# EAGLE design ECU_1v0 (EAGLE 9.0.1)
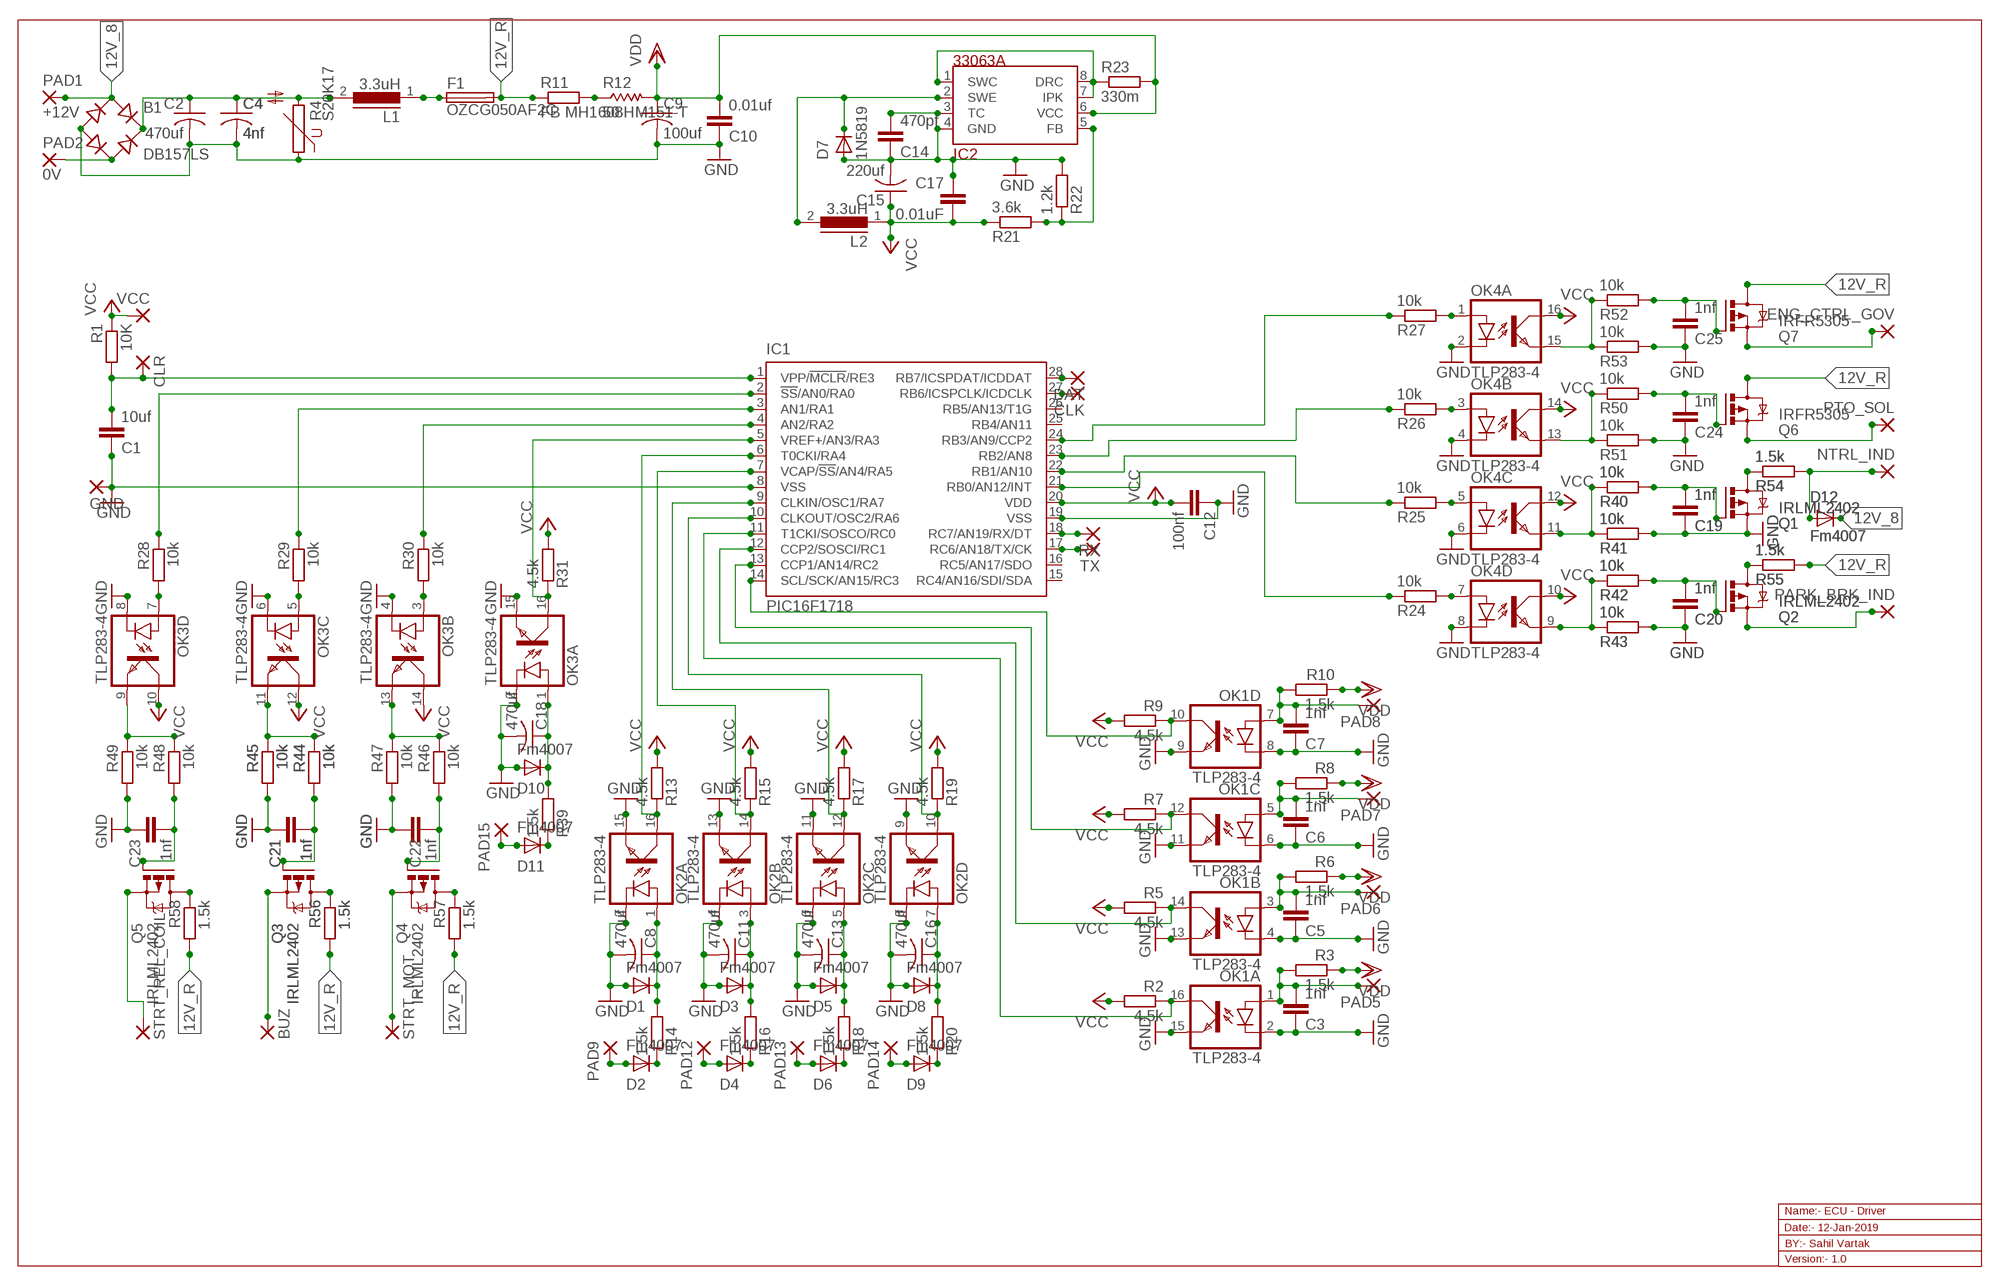
[diagram p0: schematic, sheet 1]

## Parts
B1  DB157LS  DBS106G  [DBS]
BUZ  2,54/1,1  [2,54/1,1]
C1  10uf  CC0603  [C0603]
C2  470uf  C-US050-075X075  [C050-075X075]
C3  1nf  CC0603  [C0603]
C4  4nf  C-US050-045X075  [C050-045X075]
C5  1nf  CC0603  [C0603]
C6  1nf  CC0603  [C0603]
C7  1nf  CC0603  [C0603]
C8  470uf  C-US050-075X075  [C050-075X075]
C9  100uf  C-US025-025X050  [C025-025X050]
C10  0.01uf  CC0603  [C0603]
C11  470uf  C-US050-075X075  [C050-075X075]
C12  100nf  CC0603  [C0603]
C13  470uf  C-US050-075X075  [C050-075X075]
C14  470pf  CC0603  [C0603]
C15  220uf  C-US025-025X050  [C025-025X050]
C16  470uf  C-US050-075X075  [C050-075X075]
C17  0.01uF  CC0603  [C0603]
C18  470uf  C-US050-075X075  [C050-075X075]
C19  1nf  CC0603  [C0603]
C20  1nf  CC0603  [C0603]
C21  1nf  CC0603  [C0603]
C22  1nf  CC0603  [C0603]
C23  1nf  CC0603  [C0603]
C24  1nf  CC0603  [C0603]
C25  1nf  CC0603  [C0603]
CLK  1,6/0,8  [1,6/0,8]
CLR  1,6/0,8  [1,6/0,8]
D1  Fm4007  GF1  [SMA-DO214AC]
D2  Fm4007  GF1  [SMA-DO214AC]
D3  Fm4007  GF1  [SMA-DO214AC]
D4  Fm4007  GF1  [SMA-DO214AC]
D5  Fm4007  GF1  [SMA-DO214AC]
D6  Fm4007  GF1  [SMA-DO214AC]
D7  1N5819  GF1  [SMA-DO214AC]
D8  Fm4007  GF1  [SMA-DO214AC]
D9  Fm4007  GF1  [SMA-DO214AC]
D10  Fm4007  GF1  [SMA-DO214AC]
D11  Fm4007  GF1  [SMA-DO214AC]
D12  Fm4007  GF1  [SMA-DO214AC]
DAT  1,6/0,8  [1,6/0,8]
ENG_CTRL_GOV  2,54/1,1  [2,54/1,1]
F1  OZCG050AF2C  RES_FUSE  [RES_FUSE]
GND  1,6/0,8  [1,6/0,8]
IC1  PIC16F1718  PIC16F1516/18SO  [SO28W]
IC2  33063A  [D_R-PDSO-G8]
L1  3.3uH  82114R  [82114R]
L2  3.3uH  82114R  [82114R]
NTRL_IND  2,54/1,1  [2,54/1,1]
OK1  TLP283-4  [MINI-FLAT-16]
OK2  TLP283-4  [MINI-FLAT-16]
OK3  TLP283-4  [MINI-FLAT-16]
OK4  TLP283-4  [MINI-FLAT-16]
PAD1  +12V  2,54/1,1  [2,54/1,1]
PAD2  0V  2,54/1,1  [2,54/1,1]
PAD5  2,54/1,1  [2,54/1,1]
PAD6  2,54/1,1  [2,54/1,1]
PAD7  2,54/1,1  [2,54/1,1]
PAD8  2,54/1,1  [2,54/1,1]
PAD9  2,54/1,1  [2,54/1,1]
PAD12  2,54/1,1  [2,54/1,1]
PAD13  2,54/1,1  [2,54/1,1]
PAD14  2,54/1,1  [2,54/1,1]
PAD15  2,54/1,1  [2,54/1,1]
PARK_BRK_IND  2,54/1,1  [2,54/1,1]
PTO_SOL  2,54/1,1  [2,54/1,1]
Q1  IRLML2402  IRLML5203  [MICRO3]
Q2  IRLML2402  IRLML5203  [MICRO3]
Q3  IRLML2402  IRLML5203  [MICRO3]
Q4  IRLML2402  IRLML5203  [MICRO3]
Q5  IRLML2402  IRLML5203  [MICRO3]
Q6  IRFR5305  [D-PAK_TO252AA]
Q7  IRFR5305  [D-PAK_TO252AA]
R1  10K  RR0603  [R0603]
R2  4.5k  RR0603  [R0603]
R3  1.5k  RR0603  [R0603]
R4  S20K17  S14K17  [S14K17]
R5  4.5k  RR0603  [R0603]
R6  1.5k  RR0603  [R0603]
R7  4.5k  RR0603  [R0603]
R8  1.5k  RR0603  [R0603]
R9  4.5k  RR0603  [R0603]
R10  1.5k  RR0603  [R0603]
R11  FB MH1608HM151-T  R-EU_R0603  [R0603]
R12  50  R-US_WSC2515  [WSC2515]
R13  4.5k  RR0603  [R0603]
R14  1.5k  RR0603  [R0603]
R15  4.5k  RR0603  [R0603]
R16  1.5k  RR0603  [R0603]
R17  4.5k  RR0603  [R0603]
R18  1.5k  RR0603  [R0603]
R19  4.5k  RR0603  [R0603]
R20  1.5k  RR0603  [R0603]
R21  3.6k  RR0603  [R0603]
R22  1.2k  RR0603  [R0603]
R23  330m  RR2010  [R2010]
R24  10k  RR0603  [R0603]
R25  10k  RR0603  [R0603]
R26  10k  RR0603  [R0603]
R27  10k  RR0603  [R0603]
R28  10k  RR0603  [R0603]
R29  10k  RR0603  [R0603]
R30  10k  RR0603  [R0603]
R31  4.5k  RR0603  [R0603]
R39  1.5k  RR0603  [R0603]
R40  10k  RR0603  [R0603]
R41  10k  RR0603  [R0603]
R42  10k  RR0603  [R0603]
R43  10k  RR0603  [R0603]
R44  10k  RR0603  [R0603]
R45  10k  RR0603  [R0603]
R46  10k  RR0603  [R0603]
R47  10k  RR0603  [R0603]
R48  10k  RR0603  [R0603]
R49  10k  RR0603  [R0603]
R50  10k  RR0603  [R0603]
R51  10k  RR0603  [R0603]
R52  10k  RR0603  [R0603]
R53  10k  RR0603  [R0603]
R54  1.5k  RR0603  [R0603]
R55  1.5k  RR0603  [R0603]
R56  1.5k  RR0603  [R0603]
R57  1.5k  RR0603  [R0603]
R58  1.5k  RR0603  [R0603]
RX  1,6/0,8  [1,6/0,8]
STRT_MOT  2,54/1,1  [2,54/1,1]
STRT_REL_COIL  2,54/1,1  [2,54/1,1]
TX  1,6/0,8  [1,6/0,8]
VCC  1,6/0,8  [1,6/0,8]

## Nets
12V_8: B1.AC1 D12.K(C) PAD1.1(P)
12V_R: F1.2 Q6.4(D) Q7.4(D) R11.1 R55.2 R56.2 R57.2 R58.2
GND: B1.- C1.1 C2.2 C3.1 C4.2 C5.1 C6.1 C7.1 C8.2 C9.2 C10.1 C11.2 C12.1 C13.2 C14.1 C15.2 C16.2 C17.1 C18.2 C19.1 C20.1 C21.1 C22.1 C23.1 C24.1 C25.1 D1.A D3.A D5.A D7.A D8.A D10.A GND.1(P) IC1.8(VSS) IC1.19(VSS) IC2.4(GND) OK1.2(A:C) OK1.4(B:C) OK1.6(C:C) OK1.8(D:C) OK1.9(D:EMIT) OK1.11(C:EMIT) OK1.13(B:EMIT) OK1.15(A:EMIT) OK2.2(A:C) OK2.4(B:C) OK2.6(C:C) OK2.8(D:C) OK2.9(D:EMIT) OK2.11(C:EMIT) OK2.13(B:EMIT) OK2.15(A:EMIT) OK3.2(A:C) OK3.4(B:C) OK3.6(C:C) OK3.8(D:C) OK3.15(A:EMIT) OK4.2(A:C) OK4.4(B:C) OK4.6(C:C) OK4.8(D:C) Q1.2(S) R4.1 R22.2 R41.2 R43.2 R45.2 R47.2 R49.2 R51.2 R53.2
N$1: IC1.4(AN2/RA2) R30.1
N$3: IC1.21(RB0/AN12/INT) R24.1
N$5: PARK_BRK_IND.1(P) Q2.2(S)
N$6: IC1.10(CLKOUT/OSC2/RA6) OK2.10(D:COL) R19.1
N$7: IC1.11(T1CKI/SOSCO/RC0) OK1.16(A:COL) R2.1
N$8: IC1.23(RB2/AN8) R26.1
N$9: IC1.13(CCP1/AN14/RC2) OK1.12(C:COL) R7.1
N$13: IC1.14(SCL/SCK/AN15/RC3) OK1.10(D:COL) R9.1
N$14: C1.2 CLR.1(P) IC1.1(VPP/!MCLR!/RE3) R1.2
N$15: R11.2 R12.1
N$16: IC1.24(RB3/AN9/CCP2) R27.1
N$17: IC1.22(RB1/AN10) R25.1
N$18: IC2.1(SWC) IC2.7(IPK) IC2.8(DRC) R23.1
N$19: C14.2 IC2.3(TC)
N$20: BUZ.1(P) Q3.2(S)
N$21: F1.1 L1.1
N$22: D7.K(C) IC2.2(SWE) L2.2
N$23: IC2.5(FB) R21.2 R22.1
N$24: Q4.2(S) STRT_MOT.1(P)
N$25: Q5.2(S) STRT_REL_COIL.1(P)
N$26: PTO_SOL.1(P) Q6.3(S)
N$27: ENG_CTRL_GOV.1(P) Q7.3(S)
N$28: IC1.18(RC7/AN19/RX/DT) RX.1(P)
N$29: B1.+ C2.1 C4.1 L1.2 R4.2
N$30: IC1.17(RC6/AN18/TX/CK) TX.1(P)
N$35: C3.2 OK1.1(A:A) PAD5.1(P) R3.2
N$37: B1.AC2 PAD2.1(P)
N$38: C5.2 OK1.3(B:A) PAD6.1(P) R6.2
N$39: C6.2 OK1.5(C:A) PAD7.1(P) R8.2
N$40: C7.2 OK1.7(D:A) PAD8.1(P) R10.2
N$41: C8.1 D1.K(C) OK2.1(A:A) R14.2
N$42: D2.K(C) R14.1
N$43: D2.A PAD9.1(P)
N$44: C11.1 D3.K(C) OK2.3(B:A) R16.2
N$45: D4.K(C) R16.1
N$46: D4.A PAD12.1(P)
N$47: C13.1 D5.K(C) OK2.5(C:A) R18.2
N$48: D6.K(C) R18.1
N$49: D6.A PAD13.1(P)
N$50: C16.1 D8.K(C) OK2.7(D:A) R20.2
N$51: D9.K(C) R20.1
N$52: D9.A PAD14.1(P)
N$53: C18.1 D10.K(C) OK3.1(A:A) R39.2
N$54: D11.K(C) R39.1
N$55: D11.A PAD15.1(P)
N$56: OK4.7(D:A) R24.2
N$57: OK4.5(C:A) R25.2
N$58: OK4.3(B:A) R26.2
N$59: OK4.1(A:A) R27.2
N$60: OK3.7(D:A) R28.2
N$61: OK3.5(C:A) R29.2
N$62: OK3.3(B:A) R30.2
N$63: IC1.2(!SS!/AN0/RA0) R28.1
N$64: IC1.3(AN1/RA1) R29.1
N$66: IC1.5(VREF+/AN3/RA3) OK3.16(A:COL) R31.1
N$67: IC1.6(T0CKI/RA4) OK2.16(A:COL) R13.1
N$68: IC1.7(VCAP/!SS!/AN4/RA5) OK2.14(B:COL) R15.1
N$69: IC1.9(CLKIN/OSC1/RA7) OK2.12(C:COL) R17.1
N$83: IC1.12(CCP2/SOSCI/RC1) OK1.14(B:COL) R5.1
N$86: C19.2 Q1.1(G) R40.2
N$96: C20.2 Q2.1(G) R42.2
N$97: OK4.11(C:EMIT) R40.1 R41.1
N$98: OK4.9(D:EMIT) R42.1 R43.1
N$99: C21.2 Q3.1(G) R44.2
N$100: OK3.11(C:EMIT) R44.1 R45.1
N$101: C22.2 Q4.1(G) R46.2
N$102: OK3.13(B:EMIT) R46.1 R47.1
N$103: C23.2 Q5.1(G) R48.2
N$104: OK3.9(D:EMIT) R48.1 R49.1
N$105: C24.2 Q6.1(G) R50.2
N$106: OK4.13(B:EMIT) R50.1 R51.1
N$107: C25.2 Q7.1(G) R52.2
N$108: OK4.15(A:EMIT) R52.1 R53.1
N$111: Q1.3(D) R54.1
N$112: Q2.3(D) R55.1
N$113: Q3.3(D) R56.1
N$114: Q4.3(D) R57.1
N$115: Q5.3(D) R58.1
N$116: D12.A NTRL_IND.1(P) R54.2
N$123: DAT.1(P) IC1.28(RB7/ICSPDAT/ICDDAT)
N$124: CLK.1(P) IC1.27(RB6/ICSPCLK/ICDCLK)
VCC: C12.2 C15.1 C17.2 IC1.20(VDD) L2.1 OK3.10(D:COL) OK3.12(C:COL) OK3.14(B:COL) OK4.10(D:COL) OK4.12(C:COL) OK4.14(B:COL) OK4.16(A:COL) R1.1 R2.2 R5.2 R7.2 R9.2 R13.2 R15.2 R17.2 R19.2 R21.1 R31.2 VCC.1(P)
VDD: C9.1 C10.2 IC2.6(VCC) R3.1 R6.1 R8.1 R10.1 R12.2 R23.2
Unconnected: IC1.15(RC4/AN16/SDI/SDA) IC1.16(RC5/AN17/SDO) IC1.25(RB4/AN11) IC1.26(RB5/AN13/T1G)

## Notes on the sheet
- Name:- ECU - Driver
- Date:- 12-Jan-2019
- BY:- Sahil Vartak
- Version:- 1.0

## Library data of the parts
B1 = rectifier:DB?*G: Single Phase 1.0 AMP Glass Passivated Bridge Rectifier Taiwan Semiconductor Co.,Ltd. - TSC Source: http://www.taiwansemi.com/TSCbig5/ezcatfiles/cust/img/img/db101g.pdf http://www.ts.com.tw/db/pictures/modules/PDT/PDT060207001/DBLS201G.pdf
BUZ ENG_CTRL_GOV NTRL_IND PAD1 PAD2 PAD5-PAD9 PAD12-PAD15 PARK_BRK_IND PTO_SOL STRT_MOT STRT_REL_COIL = wirepad:2,54/1,1: THROUGH-HOLE PAD
C1 C3 C5-C7 C10 C12 C14 C17 C19-C25 = eagle-ltspice:C: CAPACITOR, European symbol; SPICEMODEL: NONE; SPICEPREFIX: C
C2 C8 C11 C13 C16 C18 = resistor:C-US: CAPACITOR, American symbol
C4 C9 C15 = rcl:C-US: CAPACITOR, American symbol
CLK CLR DAT GND RX TX VCC = wirepad:1,6/0,8: THROUGH-HOLE PAD
D1-D12 = diode:GF1: DIODE
F1 = fuse:RES_FUSE
IC1 = microchip:PIC16*F1516/18: 28/40/44-Pin Flash Microcontrollers with nanoWatt XLP Technology PIC16F1516/1518 AND PIC16LF1516/1518 Source: www.microchip.com PIC16F1516.pdf
IC2 = linear:33063A
L1 L2 = inductors:82114R: INDUCTOR; SPICEPREFIX: L
OK1-OK4 = optocoupler:TLP283-4: TOSHIBA PHOTOCOUPLER GaAs IRED & PHOTO-TRANSISTOR Source: http://www.semicon.toshiba.co.jp/td/en/Opto/Photocoupler/en_20050928_TLP283_datasheet.pdf; OC_FARNELL: unknown; OC_NEWARK: unknown
Q1-Q5 = transistor-power:IRLML5203: HEXFET P-Channel Power MOSFET
Q6 Q7 = transistor-power:IRF?5305: HEXFET Power MOSFET Source: http://www.irf.com/product-info/datasheets/data/irfr5305pbf.pdf
R1-R3 R5-R10 R13-R31 R39-R58 = eagle-ltspice:R: RESISTOR, European symbol; SPICEMODEL: NONE; SPICEPREFIX: R
R4 = varistor:S14K17: VARISTOR
R11 = resistor:R-EU_: RESISTOR, European symbol
R12 = resistor:R-US_: RESISTOR, American symbol

## Board
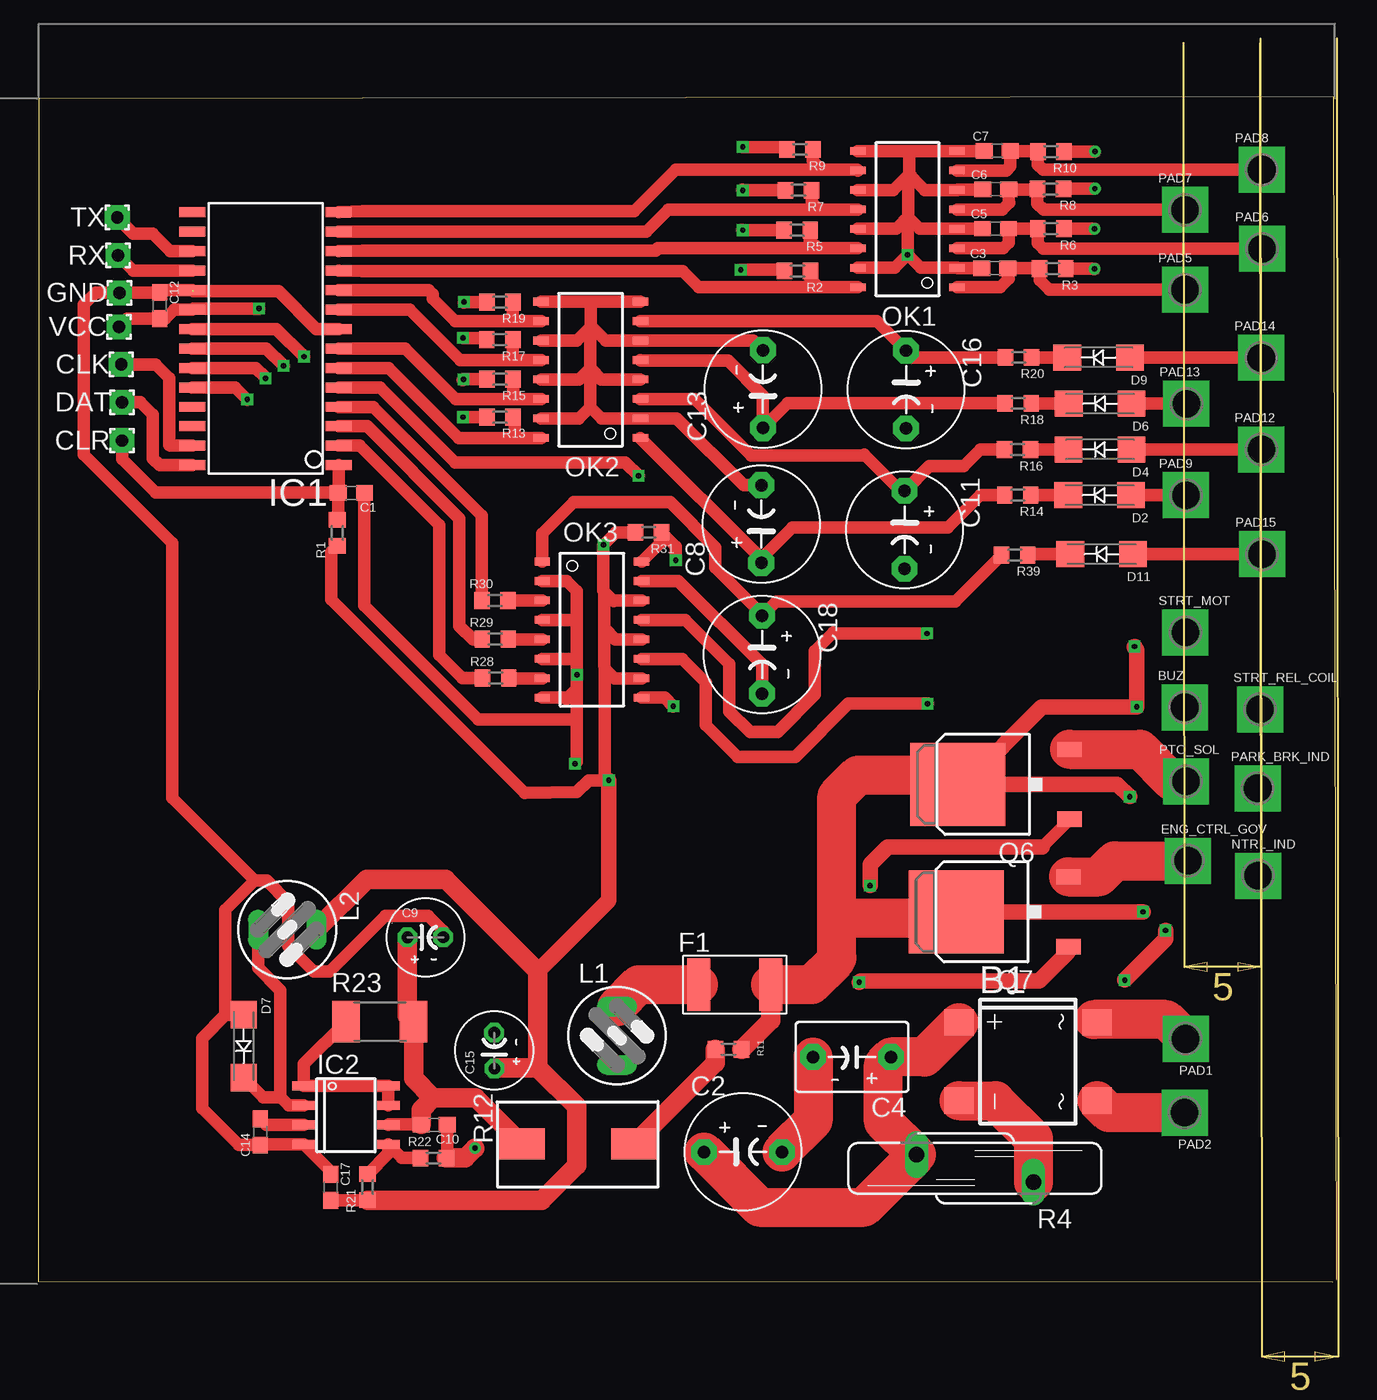
[diagram p1: board, top side]
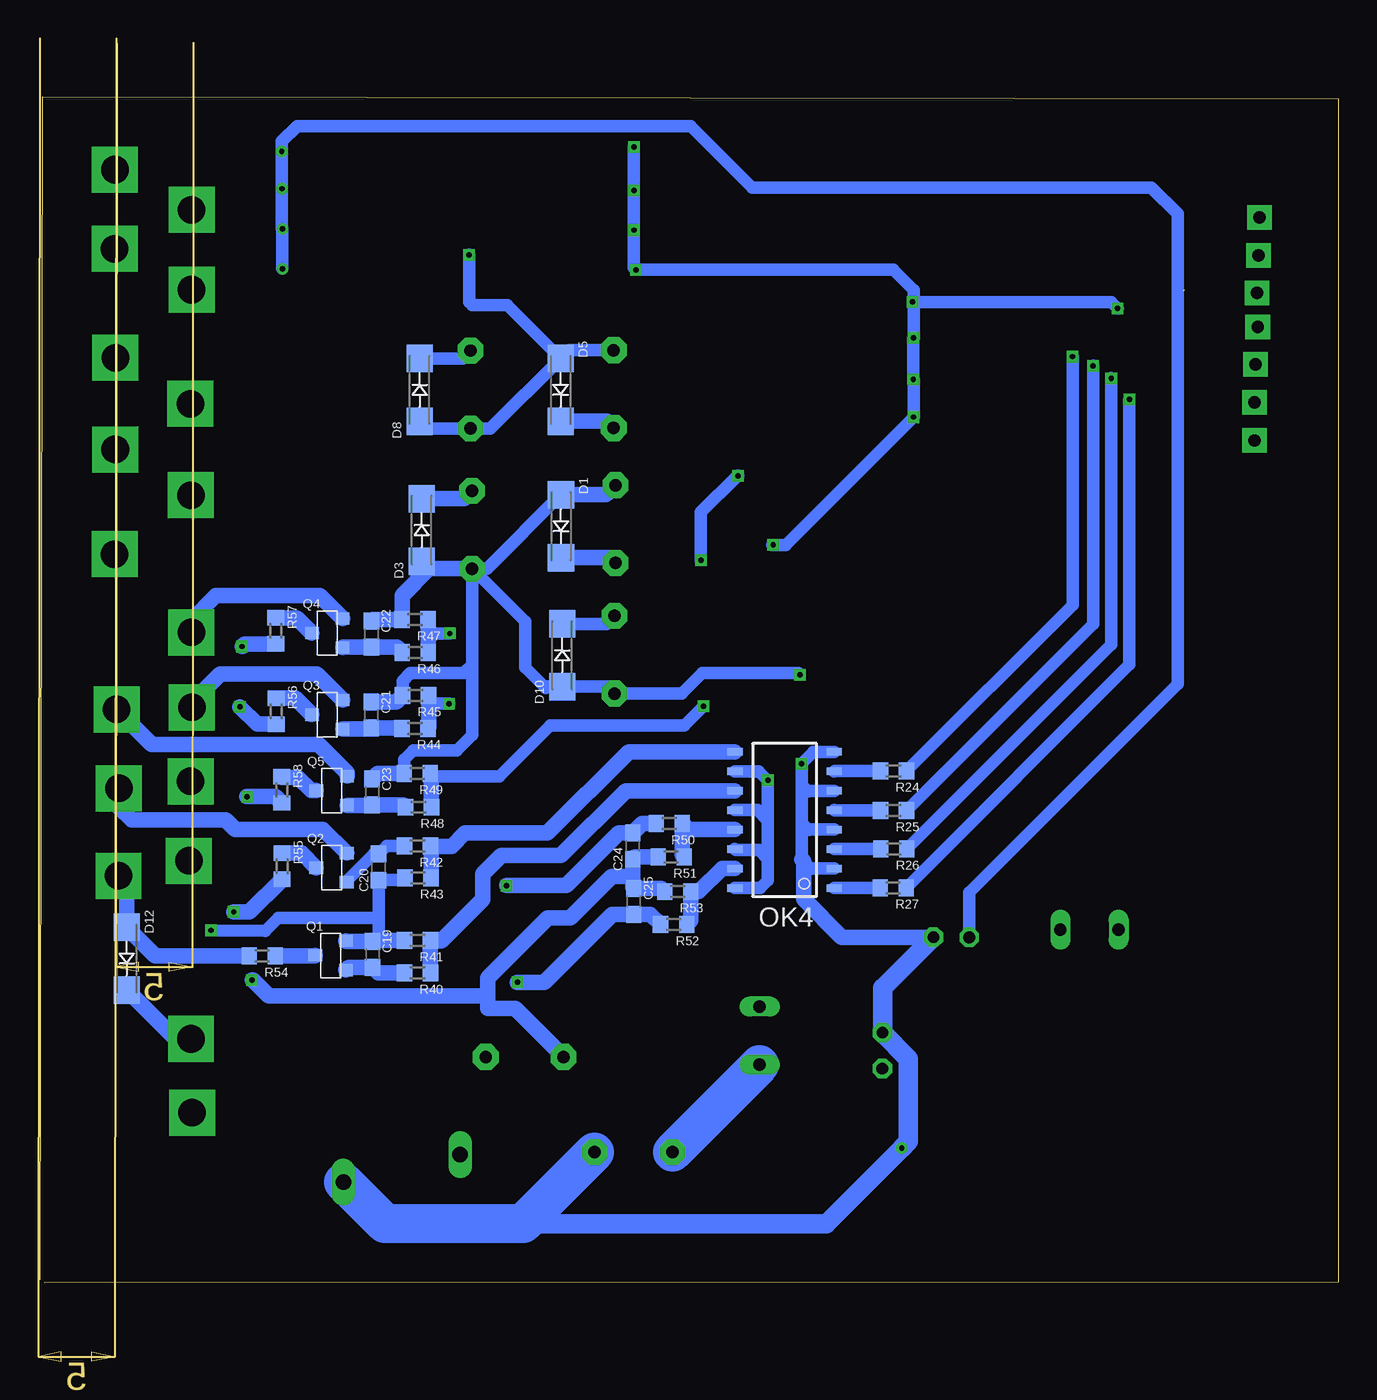
[diagram p2: board, bottom side, seen from below]

Size 84.7 x 77.37 mm. Coordinates in mm from the lower left corner, seen from the top.
Outline: 84.7,0.17 84.52,77.37 0.02,77.25 0,0.03 84.45,0
Copper layers (1*16): Top 0.035mm / dielectric 1.5mm / Bottom 0.035mm
Design rules "default": minimum track width 10mil, minimum drill 24mil, track to track 8mil, track to pad 8mil, pad to pad 8mil, via to via 8mil, smd to smd 8mil, copper to edge 40mil, drill to drill 8mil, minimum pad ring 10mil, minimum via ring 8mil, stop-mask expansion 4mil, vias tented up to drill 0mil, thermal gap 10mil

### Footprints (pad centres in the part's own frame; a part is rotated, then mirrored left to right if it is on the bottom)
DBS = smd 1.7 x 1.9: + -2.55,-4.5; - 2.55,-4.5; AC1 -2.55,4.5; AC2 2.55,4.5
2,54/1,1 = drill 1.8 pad 3 square: 1 0,0
C0603 = smd 1.1 x 1: 1 -0.85,0; 2 0.85,0
C050-075X075 = drill 0.813 pad 1.676 octagon: 1 -2.54,0; 2 2.54,0
C050-045X075 = drill 0.813 pad 1.676 octagon: 1 -2.54,0; 2 2.54,0
C025-025X050 = drill 0.762 pad 1.27 octagon: 1 -1.176,-0.006; 2 1.159,0.007
1,6/0,8 = drill 0.813 pad 1.6 square: 1 0,0
SMA-DO214AC = smd 1.8 x 1.7: A -2.05,0; K 2.05,0
RES_FUSE = smd 1.5 x 3.4: 1 -2.324,-0.11; 2 2.376,-0.11
SO28W = smd 0.65 x 1.7: 1 -7.62,-4.78; 2 -6.35,-4.78; 3 -5.08,-4.78; 4 -3.81,-4.78; 5 -2.54,-4.78; 6 -1.27,-4.78; 7 0,-4.78; 8 1.27,-4.78; 9 2.54,-4.78; 10 3.81,-4.78; 11 5.08,-4.78; 12 6.35,-4.78; 13 7.62,-4.78; 14 8.89,-4.78; 15 8.89,4.78; 16 7.62,4.78; 17 6.35,4.78; 18 5.08,4.78; 19 3.81,4.78; 20 2.54,4.78; 21 1.27,4.78; 22 0,4.78; 23 -1.27,4.78; 24 -2.54,4.78; 25 -3.81,4.78; 26 -5.08,4.78; 27 -6.35,4.78; 28 -7.62,4.78
D_R-PDSO-G8 = smd 0.6 x 1.5: 1 -1.905,-2.75; 2 -0.635,-2.75; 3 0.635,-2.75; 4 1.905,-2.75; 5 1.905,2.75; 6 0.635,2.75; 7 -0.635,2.75; 8 -1.905,2.75
82114R = drill 0.813 long: 1 0,1.905; 2 0,-1.905
MINI-FLAT-16 = smd 1 x 0.5: 1 -3.24,4.445; 2 -3.24,3.175; 3 -3.24,1.905; 4 -3.24,0.635; 5 -3.24,-0.635; 6 -3.24,-1.905; 7 -3.24,-3.175; 8 -3.24,-4.445; 9 3.24,-4.445; 10 3.24,-3.175; 11 3.24,-1.905; 12 3.24,-0.635; 13 3.24,0.635; 14 3.24,1.905; 15 3.24,3.175; 16 3.24,4.445
MICRO3 = smd 0.8 x 0.9: 1 -0.95,-1; 2 0.95,-1; 3 0,1
D-PAK_TO252AA = smd 1 x 1.6: 1 -2.28,-4.8; 3 2.28,-4.8 | smd 5.4 x 6.2: 4 0,2.5
R0603 = smd 1 x 1.1: 1 -0.85,0; 2 0.85,0
S14K17 = drill 1.016 long: 1 -0.889,-3.81; 2 0.889,3.81
WSC2515 = smd 3 x 2: 1 -3.575,-0.1; 2 3.775,-0.1
R2010 = smd 1.8 x 2.7: 1 -2.2,0; 2 2.2,0

### Placement (x,y rotation side)
B1  64.57,14.4 270 top
BUZ  74.8,37.52 0 top
C1  20.43,51.52 180 top
C2  45.98,8.5 0 top
C3  62.4,66.17 0 top
C4  53.09,14.7 180 top
C5  62.45,68.76 0 top
C6  62.47,71.32 0 top
C7  62.57,73.83 0 top
C8  47.17,49.48 90 top
C9  25.26,22.51 0 top
C10  25.84,10.29 180 top
C11  56.52,49.11 270 top
C12  7.92,63.75 270 top
C13  47.28,58.29 90 top
C14  14.48,9.8 90 top
C15  29.75,15.12 90 top
C16  56.62,58.26 270 top
C17  19.08,6.2 270 top
C18  47.22,40.96 270 top
C19  63.02,21.4 270 bottom
C20  62.62,27.09 90 bottom
C21  63.1,37.02 270 bottom
C22  63.09,42.31 270 bottom
C23  63.05,31.99 270 bottom
C24  46.04,28.46 90 bottom
C25  45.97,24.86 270 bottom
CLK  5.41,59.9 90 top
CLR  5.46,54.93 90 top
D1  50.72,49.34 270 bottom
D2  69.25,51.36 180 top
D3  59.81,49.09 90 bottom
D4  69.27,54.35 180 top
D5  50.75,58.24 270 bottom
D6  69.28,57.34 180 top
D7  13.39,15.4 270 top
D8  59.94,58.24 90 bottom
D9  69.18,60.35 180 top
D10  50.64,40.92 90 bottom
D11  69.38,47.52 180 top
D12  79.06,21.12 270 bottom
DAT  5.46,57.43 90 top
ENG_CTRL_GOV  75,27.5 0 top
F1  45.41,19.53 0 top
GND  5.3,64.58 90 top
IC1  14.83,60.94 90 top
IC2  20.08,10.9 270 top
L1  37.76,16.09 0 top
L2  16.24,23.01 270 top
NTRL_IND  79.59,26.52 0 top
OK1  56.71,69.38 180 top
OK2  36.04,59.55 180 top
OK3  36.12,42.59 0 top
OK4  36.13,30.17 180 bottom
PAD1  74.86,15.89 180 top
PAD2  74.79,11.07 180 top
PAD5  74.82,64.78 0 top
PAD6  79.84,67.45 0 top
PAD7  74.82,69.99 0 top
PAD8  79.82,72.61 0 top
PAD9  74.87,51.36 0 top
PAD12  79.8,54.35 0 top
PAD13  74.9,57.34 0 top
PAD14  79.79,60.34 0 top
PAD15  79.85,47.52 0 top
PARK_BRK_IND  79.56,32.23 0 top
PTO_SOL  74.88,32.69 0 top
Q1  65.75,21.32 90 bottom
Q2  65.69,27.05 90 bottom
Q3  65.97,37.04 90 bottom
Q4  65.97,42.37 90 bottom
Q5  65.68,32.08 90 bottom
Q6  62.49,32.49 90 top
Q7  62.4,24.17 90 top
R1  19.51,48.91 90 top
R2  49.53,66 180 top
R3  66.18,66.14 180 top
R4  61.11,7.43 90 top
R5  49.51,68.66 180 top
R6  66.06,68.75 180 top
R7  49.6,71.26 180 top
R8  66.04,71.35 180 top
R9  49.69,73.93 180 top
R10  66.07,73.79 180 top
R11  45.03,15.19 180 top
R12  35.32,8.93 180 top
R13  30.12,56.47 180 top
R14  63.9,51.37 180 top
R15  30.13,58.93 180 top
R16  63.88,54.33 180 top
R17  30.11,61.51 180 top
R18  63.93,57.36 180 top
R19  30.12,63.97 180 top
R20  63.96,60.36 180 top
R21  21.48,6.2 90 top
R22  25.78,8.1 0 top
R23  22.28,17 0 top
R24  29.03,33.37 180 bottom
R25  29.02,30.78 180 bottom
R26  29.01,28.28 180 bottom
R27  29.04,25.74 180 bottom
R28  29.84,39.43 0 top
R29  29.81,41.98 0 top
R30  29.79,44.5 0 top
R31  39.82,48.94 180 top
R39  63.7,47.47 180 top
R40  60.09,20.18 180 bottom
R41  60.08,22.3 180 bottom
R42  60.08,28.47 180 bottom
R43  60.05,26.39 180 bottom
R44  60.25,36.15 180 bottom
R45  60.21,38.29 180 bottom
R46  60.23,41.1 180 bottom
R47  60.24,43.24 180 bottom
R48  60.02,31 180 bottom
R49  60.1,33.2 180 bottom
R50  43.66,29.93 180 bottom
R51  43.53,27.75 180 bottom
R52  43.37,23.34 180 bottom
R53  43.1,25.49 180 bottom
R54  70.21,21.29 180 bottom
R55  68.92,27.15 270 bottom
R56  69.3,37.27 270 bottom
R57  69.32,42.51 270 bottom
R58  68.95,32.13 270 bottom
RX  5.2,67.01 90 top
STRT_MOT  74.84,42.41 0 top
STRT_REL_COIL  79.72,37.39 0 top
TX  5.15,69.5 90 top
VCC  5.26,62.36 90 top

### Tracks (layer width: path | path; a pad name or v marks a point on that pad's centre or on a via)
12V_8
  Top 1.27: 68.87,17.15 B1.AC1
  Top 2.54: PAD1.1 73.59,17.15 68.87,17.15
  Bottom 1.016: PAD1.1 75.87,15.89 D12.K
12V_R  (via drill 0.35)
  Top 1.016: Q7.4 v72.07,24.17 v72.08,24.18 | v71.21,31.69 70.41,32.49 Q6.4 60.44,32.49 65.48,37.53 71.65,37.53 v71.67,37.55 71.67,41.27 71.5,41.44 71.5,41.46 v71.53,41.49
  Top 1.27: F1.2 47.79,17.1 R11.1
  Top 2.54: 52.1,23.74 52.1,31.73 53.47,33.1 59.38,33.1 Q6.4 | Q7.4 59.46,23.74 52.1,23.74 | F1.2 50.46,19.42 52.02,20.98 52.1,21.19 52.1,23.74
  Bottom 1.016: v72.07,24.17 71.05,24.17 R55.2 | v71.21,31.69 69.36,31.69 R58.2 | v71.67,37.55 70.54,36.42 R56.2 | v71.53,41.49 71.36,41.66 R57.2
GND  (via drill 0.35)  (1 unrouted)
  Top 0.813: C17.1 19.08,7.25 IC2.4 14.53,9 C14.1 13.09,8.95 10.68,11.36 10.68,15.92 12.21,17.45 | R22.2 26.69,8.16 C10.1 | C6.1 59.98,71.32 OK1.6 57.84,71.29 57.16,71.97 | C7.1 OK1.8 56.81,73.83 | C5.1 61.59,68.75 OK1.4 57.52,68.75 56.75,69.52 | C3.1 59.98,66.17 OK1.2 57.57,66.21 v56.72,67.05 | 56.81,73.83 OK1.9 | OK1.11 55.77,71.29 56.81,72.32 | 56.81,72.32 56.81,73.83 | 57.16,71.97 56.81,72.32 | OK1.13 55.98,68.75 56.46,69.24 | 56.46,69.24 56.75,69.52 | 56.75,69.52 56.75,71.56 57.16,71.97 | OK1.15 55.87,66.21 v56.72,67.05 | v56.72,67.05 56.72,68.98 56.46,69.24 | D7.A 12.21,17.45 | 12.21,17.45 12.21,24.3 14.12,26.21 | 14.12,26.21 14.91,26.21 16.32,24.8 16.32,21.94 17.98,20.28 19.02,20.28 22.63,23.89 25.45,23.89 26.42,22.93 C9.2 | OK2.9 36.04,64 | 36.04,64 OK2.8 | OK2.11 35.12,61.46 36,62.33 | 36.08,62.41 36.04,62.45 36.04,64 | 36.08,62.41 37.03,61.46 OK2.6 46.66,61.46 C13.2 | OK2.13 35.27,58.92 36,59.65 | 36,59.65 36,62.33 | 36,62.33 36.08,62.41 | OK2.4 36.73,58.92 36,59.65 | OK2.15 35.25,56.38 36,57.12 | 36,57.12 36,59.65 | 36,57.12 36.74,56.38 OK2.2 41.66,56.38 46.02,52.02 C8.2 | 35.13,40.69 OK3.6 | 35.13,40.69 35.13,43.15 | 35.13,43.15 35.13,45.12 34.48,45.77 OK3.2 | 35.13,40.69 v35.13,39.65 35.13,38.74 | 35.13,38.74 34.45,38.05 34.35,38.15 OK3.8 | OK3.4 35.06,43.23 35.13,43.15 | OK3.15 41.77,45.77 47.22,40.31 C18.2 | IC1.8 18.15,62.21 15.68,64.68 10.12,64.68 | 35.13,38.74 35.13,36.71 | 35.13,36.71 35.13,33.97 v35.02,33.85 | C1.1 21.28,44.15 28.69,36.74 35.1,36.74 35.13,36.71 | IC1.19 8.07,64.75 C12.1 5.32,64.6 GND.1 3.74,64.58 2.96,63.8 2.96,54.01 8.74,48.23 8.74,31.59 14.12,26.21
  Top 1.016: v70.88,19.72 73.55,22.39 v73.55,22.96
  Top 1.27: v28.49,8.74 27.85,8.1 R22.2
  Top 2.54: B1.- 62.45,11.85 64.92,9.38 R4.1 | C4.2 50.55,10.53 C2.2
  Bottom 0.813: C13.2 50.21,60.83 D5.A | D5.A 55.32,55.72 C16.2 59.47,55.72 D8.A | D1.A 55.54,46.57 C11.2 | C11.2 53.06,43.11 53.06,40.12 51.71,38.77 51.61,38.87 D10.A 47.67,38.87 C18.2 42.85,38.42 41.52,39.75 35.23,39.75 v35.13,39.65 | D5.A 54.23,63.77 56.52,63.77 56.72,63.97 v56.72,67.05 | OK4.8 34.25,34.62 v35.02,33.85 35.02,32.46 | 35.02,32.46 34.59,32.03 34.54,32.08 OK4.6 | 35.02,32.46 35.02,29.98 | 35.02,29.98 34.56,29.52 34.54,29.54 OK4.4 | 35.02,29.98 35.02,27.59 34.39,26.96 34.35,27 OK4.2 | C11.2 56.52,40.28 | 56.52,40.28 57.05,39.75 60.55,39.75 61.06,39.24 R45.2 | 56.52,40.28 56.52,35.72 57.53,34.71 60.36,34.71 60.96,34.11 60.95,34.1 R49.2 | R43.2 61.05,26.24 C20.1 62.62,23.78 | 62.62,23.78 62.62,22.65 62.97,22.3 | 62.62,23.78 69.18,23.78 70.03,22.93 v73.55,22.96
  Bottom 1.016: R41.2 62.97,22.3 C19.1 64.73,22.25 Q1.2 | R49.2 62.69,33.2 C23.1 | C21.1 61.48,37.87 R45.2 | C22.1 63.01,43.24 R47.2 61.09,44.82 59.34,46.57 | D1.A 47.8,51.39 C8.2 | C11.2 59.34,46.57 | 59.34,46.57 D3.A | R53.2 44.17,25.71 C25.1 46.04,25.78 46.04,26.47 | 46.04,26.47 C24.1 45.9,27.75 R51.2 | C4.2 53.71,17.86 55.51,17.86 55.51,18.67 | 55.51,18.67 55.51,19.85 51.57,23.79 50.1,23.79 47.42,26.47 46.04,26.47 | 55.51,18.67 69.79,18.67 70.84,19.72 v70.88,19.72 | C9.2 32.39,22.52 34.88,25.01 34.88,27.45 35.02,27.59
  Bottom 1.27: C9.2 29.74,19.2 C15.2 28.05,14.59 28.05,9.18 v28.49,8.74 33.42,3.81 53.21,3.81
  Bottom 2.54: C2.2 53.21,3.81 62.19,3.81 R4.1
  other vias: 29.74,16.28
  cutout Top (isolate 0.61, no thermals): 0.44,77.58 85.19,77.57 84.73,-0.01 -0.02,0
  cutout Bottom (isolate 0.61): 0.39,77.21 84.91,77.41 84.5,-0.23 0.08,-0.43
N$1
  Top 0.813: IC1.4 21.84,57.13 28.94,50.03 R30.1
N$3  (via drill 0.35)
  Top 0.813: IC1.21 15.54,62.21 v17.34,60.41
  Bottom 0.813: v17.34,60.41 17.34,44.21 R24.1
N$5
  Bottom 1.016: Q2.2 66.25,29.56 71.98,29.56 72.58,30.16 78.73,30.16 79.56,30.99 PARK_BRK_IND.1
N$6
  Top 0.813: OK2.10 31.06,62.73 | 31.06,62.73 27.21,62.73 25.74,64.2 25.74,64.5 25.49,64.75 IC1.10 | R19.1 30.97,62.82 31.06,62.73
N$7
  Top 0.813: OK1.16 50.93,64.94 | R2.1 50.38,65.49 50.93,64.94 | 50.93,64.94 43.1,64.94 42.05,65.99 21.15,65.99 IC1.11
N$8  (via drill 0.35)
  Top 0.813: IC1.23 14.19,59.67 14.8,59.06 14.8,59.02 v14.82,59
  Bottom 0.813: v14.82,59 14.82,41.62 R26.1
N$9
  Top 0.813: OK1.12 50.89,70.02 | 50.89,70.02 50.45,70.46 R7.1 | 50.89,70.02 41.09,70.02 39.65,68.58 21.14,68.58 IC1.13
N$13
  Top 0.813: R9.1 50.54,73.2 51.13,72.61 | 51.13,72.61 53.41,72.61 OK1.10 | 51.13,72.61 41.6,72.61 38.88,69.89 21.18,69.89 IC1.14
N$14
  Top 0.813: IC1.1 19.61,51.55 C1.2 | C1.2 19.58,49.83 R1.2 | CLR.1 5.46,53.72 7.66,51.52 C1.2
N$15
  Top 1.27: R12.1 44.18,14.32 R11.2
N$16  (via drill 0.35)
  Top 0.813: v13.63,57.62 12.85,58.4 IC1.24
  Bottom 0.813: R27.1 13.63,40.3 v13.63,57.62
N$17  (via drill 0.35)
  Top 0.813: IC1.22 14.87,60.94 v16,59.81
  Bottom 0.813: v16,59.81 16,42.95 R25.1
N$18
  Top 0.813: IC2.7 IC2.8 IC2.1 17.33,14.25 R23.1
N$19
  Top 0.813: IC2.3 14.87,10.27 C14.2
N$20
  Bottom 1.016: Q3.2 66.66,39.68 72.96,39.68 74.8,37.84 BUZ.1
N$21
  Top 2.54: L1.1 39.18,19.42 F1.1
N$22
  Top 0.813: D7.K 14.69,12.05 15.81,12.05 | 15.81,12.05 16.33,11.54 IC2.2 | L2.2 14.33,20.51 15.8,19.04 15.8,12.06 15.81,12.05
N$23
  Top 0.813: R22.1 23.73,8.1 IC2.5 22.83,8.4 R21.2
N$24
  Bottom 1.016: Q4.2 66.45,44.8 73.23,44.8 74.86,43.17 74.84,43.15 STRT_MOT.1
N$25
  Bottom 1.016: Q5.2 64.68,33.23 66.53,35.08 77.41,35.08 STRT_REL_COIL.1
N$26
  Top 2.54: PTO_SOL.1 73.96,32.69 71.88,34.77 Q6.3
N$27
  Top 2.54: Q7.3 69.19,26.45 70.24,27.5 ENG_CTRL_GOV.1
N$28
  Top 0.813: RX.1 6.19,66.02 IC1.18
N$29
  Top 1.27: B1.+ 59.88,16.76
  Top 2.54: B1.+ 57.82,14.7 C4.1 55.14,14.21 55.14,10.48 R4.2 53.88,4.9 47.04,4.9 C2.1
  Bottom 2.54: C2.1 L1.2
N$30
  Top 0.813: TX.1 6.21,68.44 7.45,68.44 8.6,67.29 IC1.17
N$35
  Top 0.813: OK1.1 62.76,64.94 63.32,65.49 63.25,65.56 C3.2 65.3,66.17 R3.2 65.33,65.39 65.95,64.77 PAD5.1
N$37
  Top 2.54: PAD2.1 69.85,11.07 B1.AC2
N$38
  Top 0.813: OK1.3 62.95,67.48 63.32,67.84 63.3,67.86 C5.2 R6.2 65.21,67.8 65.57,67.44 65.58,67.45 PAD6.1
N$39
  Top 0.813: OK1.5 62.88,70.02 63.34,70.47 63.32,70.49 C6.2 65.16,71.32 R8.2 65.19,70.39 65.59,69.99 PAD7.1
N$40
  Top 0.813: OK1.7 63.15,72.56 63.42,72.83 C7.2 65.18,73.83 R10.2 65.22,72.95 65.56,72.61 PAD8.1
N$41
  Top 0.813: OK2.1 47.17,47.22 | 47.17,47.22 C8.1 | R14.2 61.45,51.37 59.32,49.24 49.2,49.24 47.17,47.22
  Bottom 1.016: D1.K 47.52,47.29 C8.1
N$42
  Top 0.813: D2.K R14.1
N$43
  Top 0.813: PAD9.1 D2.A
N$44
  Top 0.813: R16.2 61.44,54.33 60.38,53.27 58.14,53.27 C11.1 56.28,51.65 53.9,54.03 53.83,53.96 46.5,53.96 42.81,57.65 OK2.3
  Bottom 1.016: C11.1 57.03,51.14 D3.K
N$45
  Top 0.813: D4.K 64.75,54.35 R16.1
N$46
  Top 0.813: PAD12.1 D4.A
N$47
  Top 0.813: R18.2 48.89,57.36 C13.1 47.28,57.88 45.01,60.15 39.31,60.15 OK2.5
  Bottom 1.016: D5.K 47.72,56.19 C13.1
N$48
  Top 0.813: D6.K 64.8,57.34 R18.1
N$49
  Top 0.813: PAD13.1 D6.A
N$50
  Top 0.813: R20.2 57.06,60.36 C16.1 54.7,62.73 OK2.7
  Bottom 0.813: D8.K 57.13,60.29 C16.1
N$51
  Top 0.813: D9.K R20.1
N$52
  Top 0.813: PAD14.1 D9.A
N$53
  Top 0.813: R39.2 59.81,44.43 48.15,44.43 C18.1 47.22,43.58 44.17,46.63 44.17,47.96 41.23,50.9 34.92,50.9 32.88,48.86 OK3.1
  Bottom 0.813: D10.K 47.75,42.97 C18.1
N$54
  Top 0.813: D11.K 64.6,47.52 R39.1
N$55
  Top 0.813: PAD15.1 D11.A
N$56
  Bottom 0.813: R24.2 32.86,33.37 OK4.7
N$57
  Bottom 0.813: R25.2 32.86,30.78 OK4.5
N$58
  Bottom 0.813: R26.2 29.88,28.27 OK4.3
N$59
  Bottom 0.813: R27.2 29.91,25.73 OK4.1
N$60
  Top 0.813: OK3.7 30.7,39.42 R28.2
N$61
  Top 0.813: OK3.5 30.68,41.96 R29.2
N$62
  Top 0.813: OK3.3 R30.2
N$63
  Top 0.813: IC1.2 20.96,54.59 26.15,49.4 26.15,40.95 27.66,39.43 R28.1
N$64
  Top 0.813: IC1.3 21.45,55.86 27.47,49.84 27.47,42.84 28.37,41.94 28.41,41.98 R29.1
N$66  (via drill 0.35)
  Top 0.813: OK3.16 40.67,48.35 R31.1 41.59,48.02 v41.59,47.12 | IC1.5 22.3,58.4 27.21,53.49 38.31,53.49 v39.16,52.64
  Bottom 0.813: v41.59,47.12 41.59,50.25 39.23,52.61 39.19,52.61 v39.16,52.64
N$67
  Top 0.813: OK2.16 31.07,55.11 | 31.07,55.11 27.43,55.11 22.87,59.67 IC1.6 | R13.1 31.07,56.37 31.07,55.11
N$68
  Top 0.813: OK2.14 31.01,57.65 | 31.01,57.65 27.23,57.65 23.94,60.94 IC1.7 | R15.1 30.98,57.68 31.01,57.65
N$69
  Top 0.813: OK2.12 30.98,60.19 | 30.98,60.19 27.53,60.19 24.24,63.48 IC1.9 | R17.1 30.96,60.21 30.98,60.19
N$83
  Top 0.813: OK1.14 50.84,67.48 | 50.84,67.48 50.33,67.99 50.33,68.63 R5.1 | 50.84,67.48 40.41,67.48 40.27,67.33 21.16,67.33 IC1.12
N$86
  Bottom 1.016: R40.2 62.65,20.18 C19.2 64.57,20.55 Q1.1
N$96
  Bottom 0.61: 64.69,26.18 Q2.1
  Bottom 0.813: 64.69,26.18 62.93,27.94 C20.2 62.09,28.47 R42.2
N$97
  Bottom 1.016: R40.1 R41.1 | R41.1 | OK4.11 46.5,32.08 50.72,27.86 54.63,27.86 55.84,26.65 55.84,24.99 58.54,22.29 R41.1
N$98
  Bottom 1.016: OK4.9 46.31,34.62 51.62,29.31 56.99,29.31 57.86,28.44 59.2,28.44 | R43.1 59.2,28.44 | 59.2,28.44 R42.1
N$99
  Bottom 1.016: Q3.1 63.18,36.09 C21.2 61.12,36.17 R44.2
N$100  (via drill 0.35)
  Top 0.813: OK3.11 42,40.69 43.54,39.15 43.54,36.37 45.64,34.27 49.37,34.27 52.86,37.76 v58.02,37.76
  Bottom 0.813: v58.02,37.76 59.24,37.76 59.36,37.64
  Bottom 1.016: R45.1 59.36,37.64 59.36,36.19 R44.1
N$101
  Bottom 1.016: R46.2 61.44,41.46 C22.2 64.93,41.46 Q4.1
N$102  (via drill 0.35)
  Top 0.813: OK3.13 42.2,43.23 45.09,40.34 45.09,37.26 46.44,35.91 48.23,35.91 50.67,38.35 50.67,41.2 51.86,42.39 51.91,42.34 v57.98,42.34
  Bottom 0.813: v57.98,42.34 59.34,42.34 59.38,42.3
  Bottom 1.016: R46.1 59.38,42.3 R47.1
N$103
  Bottom 1.016: Q5.1 C23.2 61.01,31.14 R48.2
N$104  (via drill 0.35)
  Top 0.813: OK3.9 40.86,38.15 v41.43,37.58
  Bottom 0.813: v41.43,37.58 42.67,36.34 51.43,36.34 54.76,33.01 59.06,33.01 59.17,33.12 | 59.12,31.05 R48.1
  Bottom 1.016: R48.1 59.17,33.12 R49.1
N$105  (via drill 0.35)
  Top 0.813: Q6.1 65.49,28.41
  Top 1.016: 65.49,28.41 55.42,28.41 54.27,27.26 v54.27,25.89
  Bottom 1.016: R50.2 45.42,29.93 C24.2 46.95,29.31 50.37,25.89 v54.27,25.89
N$106
  Bottom 1.016: R51.1 42.81,27.88 R50.1 42.41,29.54 OK4.13
N$107  (via drill 0.35)
  Top 1.016: Q7.1 67.2,21.56 65.31,19.67 53.65,19.67 v53.56,19.58
  Bottom 1.016: R52.2 44.89,24.01 C25.2 47.39,24.01 51.82,19.58 v53.56,19.58
N$108
  Bottom 1.016: R52.1 42.25,23.61 R53.1 41.72,25.49 40.21,27 OK4.15
N$111
  Bottom 1.016: R54.1 66.78,21.29 Q1.3
N$112
  Bottom 1.016: Q2.3 67.64,28 R55.1
N$113
  Bottom 1.016: Q3.3 68.05,38.12 R56.1
N$114
  Bottom 1.016: Q4.3 67.96,43.36 R57.1
N$115
  Bottom 1.016: Q5.3 67.01,32.08 67.88,32.95 68.92,32.95 R58.1
N$116
  Bottom 1.016: NTRL_IND.1 79.06,27.12 D12.A 77.18,21.29 R54.2
N$123
  Top 0.813: DAT.1 6.66,57.43 7.46,56.63 7.46,53.77 7.91,53.32 IC1.28
N$124
  Top 0.813: IC1.27 8.6,54.59 8.54,54.65 8.54,59.01 7.65,59.9 CLK.1
VCC  (via drill 0.35)
  Top 0.813: R21.1 C17.2 | R9.2 48.68,74.09 v45.96,74.09 | R7.2 v45.96,71.26 45.93,71.29 | R5.2 v45.96,68.66 45.93,68.69 | R2.2 48.6,66.08 v45.83,66.08 | R19.2 v27.78,63.97 27.75,63.94 | R17.2 29.14,61.63 v27.72,61.63 | R15.2 v27.74,58.93 27.7,58.89 | R13.2 v27.72,56.46 | R31.2 37.69,48.94 v36.87,48.12 36.87,45.13 36.91,45.09 | 36.91,45.09 37.53,44.47 37.55,44.5 OK3.14 | OK3.12 37.64,41.96 36.91,42.69 | 36.91,42.69 36.91,45.09 | 36.95,40.06 36.91,40.28 36.91,42.69 | 36.95,40.06 37.59,39.42 OK3.10 | 36.95,40.06 36.95,33.01 37.22,32.74 | 37.23,32.73 37.22,32.74 | 37.22,32.74 v37.22,32.76 35.91,32.76 35.13,31.98 31.74,31.94 19.1,44.56 19.1,47.65 R1.1 | VCC.1 5.8,62.9 C12.2 8.29,62.9 8.87,63.48 IC1.20 10.12,63.55 v14.41,63.55
  Top 1.016: v37.22,32.76 37.22,24.92 32.59,20.29
  Top 1.27: R21.1 32.84,5.35 35.12,7.63 35.12,11.46 32.59,13.99 | 32.59,13.99 29.8,13.99 C15.1 | 32.59,13.99 32.59,20.29 26.58,26.3 21.43,26.3 L2.1
  Bottom 0.813: v45.96,74.09 v45.96,71.26 v45.96,68.66 45.96,66.21 v45.83,66.08 29.05,66.08 27.72,64.75 27.72,63.91 | 27.72,63.91 v27.72,61.63 27.74,61.61 v27.74,58.93 27.72,58.91 v27.72,56.46 36.06,48.12 v36.87,48.12 36.94,48.12 | 27.72,63.91 v27.78,63.97 14.83,63.97 v14.41,63.55 | OK4.16 37.7,25.73 37.22,26.21 37.22,27.63 | 37.22,27.63 37.79,28.2 39.3,28.2 OK4.14 | 37.22,27.63 37.22,30.14 | OK4.12 37.88,30.81 37.22,30.14 | 37.22,30.14 v37.22,32.76 37.8,33.35 OK4.10
VDD  (via drill 0.35)
  Top 0.813: C10.2 22.85,10.29 IC2.6 | R10.1 v68.94,73.79 | R8.1 66.91,71.37 v68.93,71.37 | R6.1 v68.9,68.75 | R3.1 v68.9,66.14 v68.91,66.13
  Top 1.27: C10.2 24.99,11.26 25.75,12.02 | 25.75,12.02 28.55,12.02 R12.2 | 25.75,12.02 24.48,13.29 R23.2 24.08,17.4 C9.1
  Bottom 0.813: v68.9,66.14 v68.9,68.75 68.93,68.78 v68.93,71.37 v68.94,71.38 v68.94,73.79 68.94,74.46 67.94,75.46 42.25,75.46 38.24,71.45 12.2,71.45 10.48,69.73 10.48,39.04 24.08,25.44 C9.1